# Altium schematic sheet rev02_14.SchDoc
size 282 x 200 mm
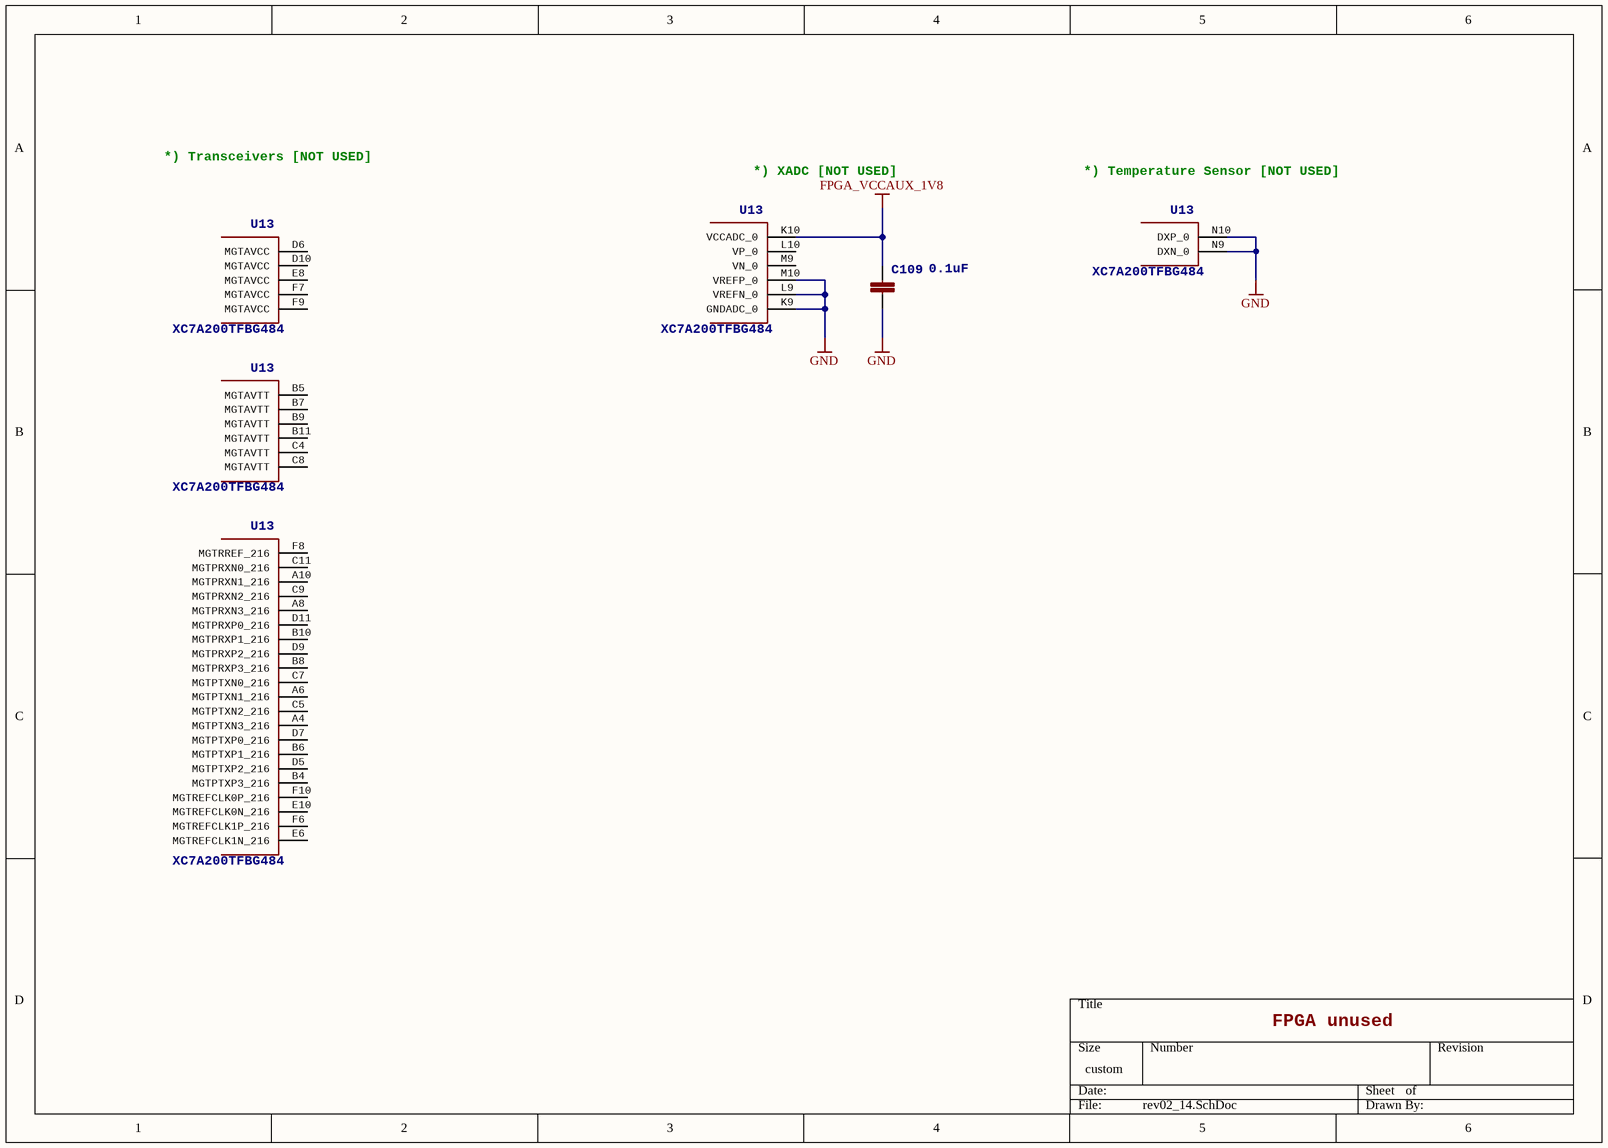
[diagram p0: rev02_14.SchDoc]

## Parts
C109  value 0.1uF  >NAME: C109  [C_0402]
U13  >NAME: U13  [BGA484C100P22X22_2300X2300X254]  (hidden comment: XC7A200TFBG484)  (parts H,K,L,M,Q of 17)

## Nets
FPGA_VCCAUX_1V8: C109.1 U13.K10(VCCADC_0)
GND: C109.2 U13.K9(GNDADC_0) U13.L9(VREFN_0) U13.M10(VREFP_0) U13.N9(DXN_0) U13.N10(DXP_0)

Not connected (* = marked no-connect by the designer): U13 A4(MGTPTXN3_216) A6(MGTPTXN1_216) A8(MGTPRXN3_216) A10(MGTPRXN1_216) B4(MGTPTXP3_216) B5(MGTAVTT) B6(MGTPTXP1_216) B7(MGTAVTT) B8(MGTPRXP3_216) B9(MGTAVTT) B10(MGTPRXP1_216) B11(MGTAVTT) C4(MGTAVTT) C5(MGTPTXN2_216) C7(MGTPTXN0_216) C8(MGTAVTT) C9(MGTPRXN2_216) C11(MGTPRXN0_216) D5(MGTPTXP2_216) D6(MGTAVCC) D7(MGTPTXP0_216) D9(MGTPRXP2_216) D10(MGTAVCC) D11(MGTPRXP0_216) E6(MGTREFCLK1N_216) E8(MGTAVCC) E10(MGTREFCLK0N_216) F6(MGTREFCLK1P_216) F7(MGTAVCC) F8(MGTRREF_216) F9(MGTAVCC) F10(MGTREFCLK0P_216) L10(VP_0) M9(VN_0)

## Notes on the sheet
- *) Transceivers [NOT USED]
- *) XADC [NOT USED]
- *) Temperature Sensor [NOT USED]
- FPGA unused

## Library data of the parts
C109 = C-EUC0402: 0402 CAPACITOR; DIELECTRIC: X7R; RATED_VOLTAGE: 50V; TOLERANCE: 10%; >VALUE: 0.1 uF
U13 = XC7A200TFBG484: Xilinx FPGA: XC7A200TFBG484; MPN: XC7A200T-1FBG484C; MFR: Xilinx; OC_DIGIKEY: 122-1871-ND; >VALUE: XC7A200TFBG484